# EAGLE schematic guage (EAGLE 7.7.0)
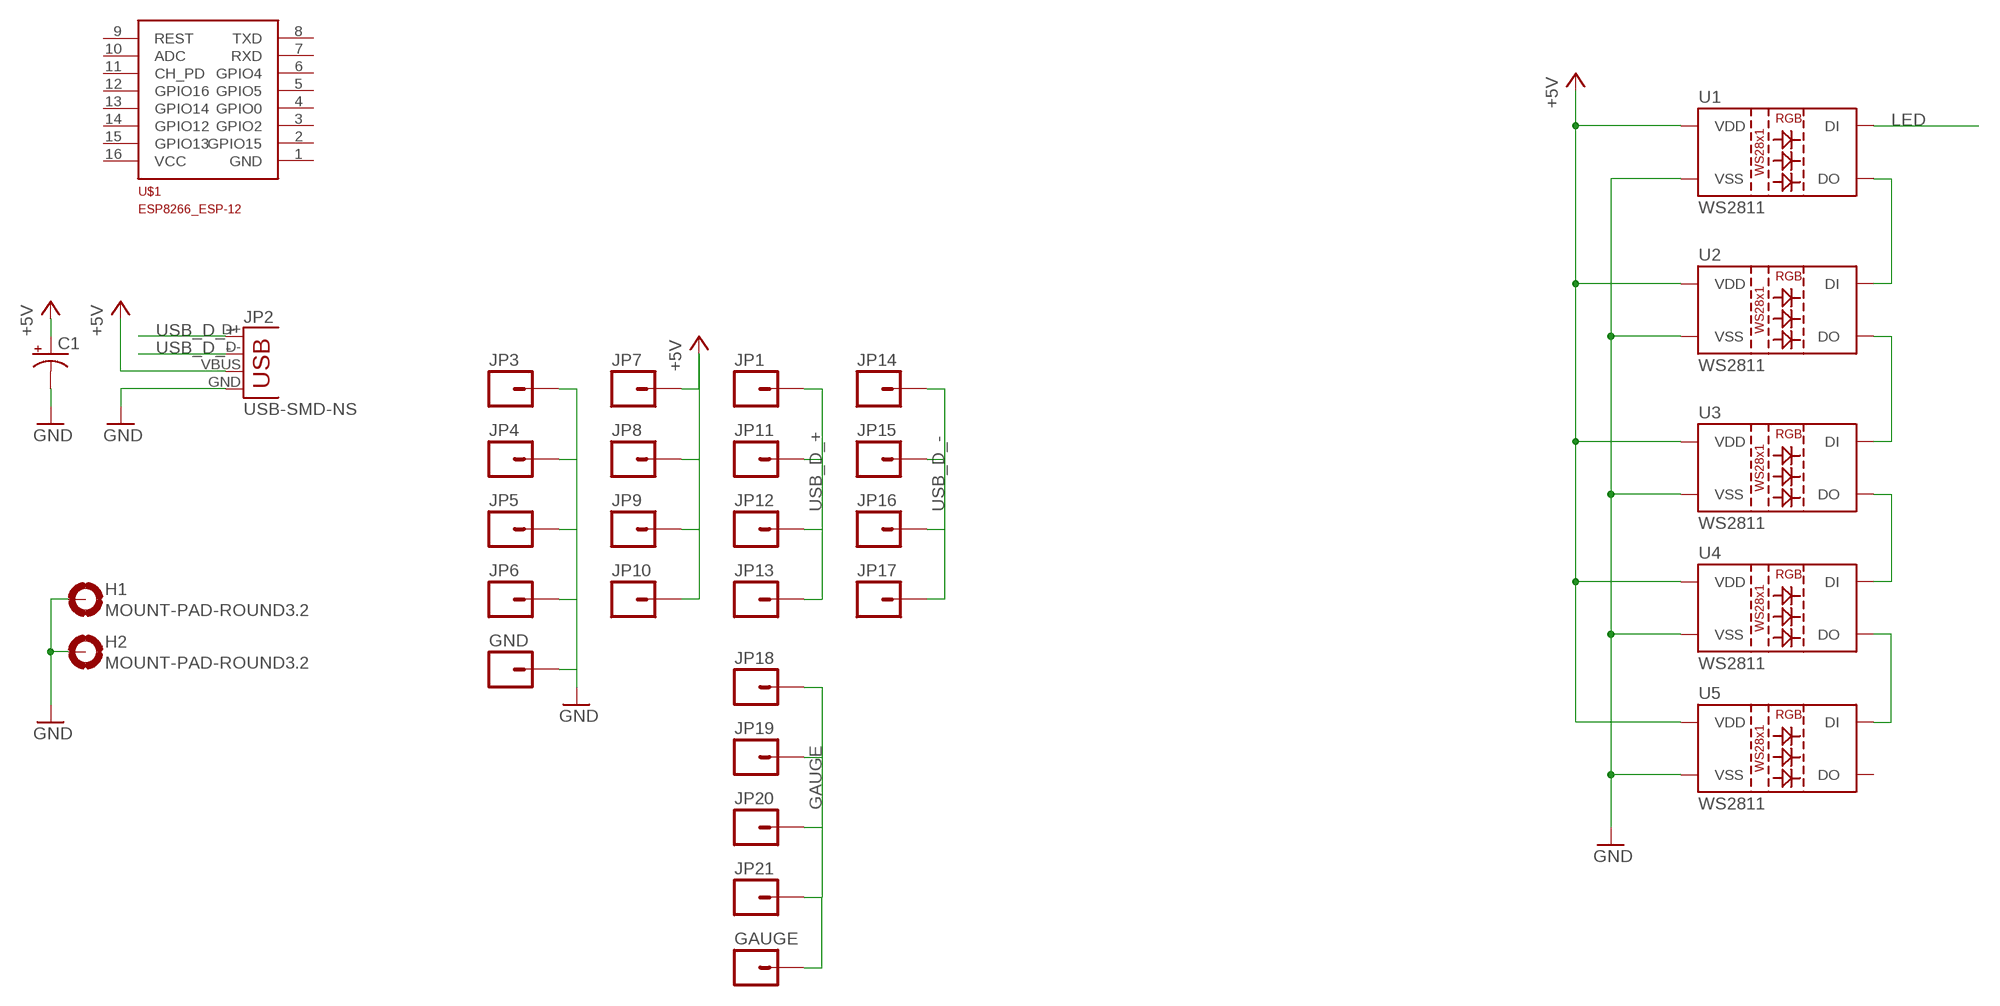
[diagram p0: schematic, sheet 1]

## Parts
C1  100UF-25V-20%(PTH)  [CPOL-RADIAL-100UF-25V]
GAUGE  M01OFFSET  [1X01_OFFSET]
GND  M01OFFSET  [1X01_OFFSET]
H1  MOUNT-PAD-ROUND3.2  [3,2-PAD]
H2  MOUNT-PAD-ROUND3.2  [3,2-PAD]
JP1  M01SMD-4.5X1.5  [PAD-1.5X4.5]
JP2  USB-SMD-NS  [USB-MINIB-NOSTOP]
JP3  M01SMD-4.5X1.5  [PAD-1.5X4.5]
JP4  M01SMD-4.5X1.5  [PAD-1.5X4.5]
JP5  M01SMD-4.5X1.5  [PAD-1.5X4.5]
JP6  M01SMD-4.5X1.5  [PAD-1.5X4.5]
JP7  M01SMD-4.5X1.5  [PAD-1.5X4.5]
JP8  M01SMD-4.5X1.5  [PAD-1.5X4.5]
JP9  M01SMD-4.5X1.5  [PAD-1.5X4.5]
JP10  M01SMD-4.5X1.5  [PAD-1.5X4.5]
JP11  M01SMD-4.5X1.5  [PAD-1.5X4.5]
JP12  M01SMD-4.5X1.5  [PAD-1.5X4.5]
JP13  M01SMD-4.5X1.5  [PAD-1.5X4.5]
JP14  M01SMD-4.5X1.5  [PAD-1.5X4.5]
JP15  M01SMD-4.5X1.5  [PAD-1.5X4.5]
JP16  M01SMD-4.5X1.5  [PAD-1.5X4.5]
JP17  M01SMD-4.5X1.5  [PAD-1.5X4.5]
JP18  M01SMD-4.5X1.5  [PAD-1.5X4.5]
JP19  M01SMD-4.5X1.5  [PAD-1.5X4.5]
JP20  M01SMD-4.5X1.5  [PAD-1.5X4.5]
JP21  M01SMD-4.5X1.5  [PAD-1.5X4.5]
U1  WS2811  LED-TRICOLOR-5050-ICWS2811  [LED-TRICOLOR-5050-IC]
U2  WS2811  LED-TRICOLOR-5050-ICWS2811  [LED-TRICOLOR-5050-IC]
U3  WS2811  LED-TRICOLOR-5050-ICWS2811  [LED-TRICOLOR-5050-IC]
U4  WS2811  LED-TRICOLOR-5050-ICWS2811  [LED-TRICOLOR-5050-IC]
U5  WS2811  LED-TRICOLOR-5050-ICWS2811  [LED-TRICOLOR-5050-IC]
U$1  ESP8266_ESP-12  [ESP8266-ESP12]

## Nets
+5V: C1.1(+) JP2.VBUS JP7.P$1 JP8.P$1 JP9.P$1 JP10.P$1 U1.3(VDD) U1.5(VDD) U2.3(VDD) U2.5(VDD) U3.3(VDD) U3.5(VDD) U4.3(VDD) U4.5(VDD) U5.3(VDD) U5.5(VDD)
GAUGE: GAUGE.1 JP18.P$1 JP19.P$1 JP20.P$1 JP21.P$1
GND: C1.2(-) GND.1 H1.B3,2(MOUNT) H2.B3,2(MOUNT) JP2.GND JP3.P$1 JP4.P$1 JP5.P$1 JP6.P$1 U1.6(VSS) U2.6(VSS) U3.6(VSS) U4.6(VSS) U5.6(VSS)
LED: U1.2(DI)
N$1: U1.1(DO) U2.2(DI)
N$2: U2.1(DO) U3.2(DI)
N$3: U3.1(DO) U4.2(DI)
N$4: U4.1(DO) U5.2(DI)
USB_D_+: JP1.P$1 JP2.D+ JP11.P$1 JP12.P$1 JP13.P$1
USB_D_-: JP2.D- JP14.P$1 JP15.P$1 JP16.P$1 JP17.P$1
Unconnected: U5.1(DO) U$1.1(GND) U$1.2(GPIO15) U$1.3(GPIO2) U$1.4(GPIO0) U$1.5(GPIO5) U$1.6(GPIO4) U$1.7(RXD) U$1.8(TXD) U$1.9(REST) U$1.10(ADC) U$1.11(CH_PD) U$1.12(GPIO16) U$1.13(GPIO14) U$1.14(GPIO12) U$1.15(GPIO13) U$1.16(VCC)

## Library data of the parts
C1 = SparkFun-Capacitors:100UF-25V-20%(PTH): CAP-08439; PROD_ID: CAP-08439
GAUGE GND JP1 JP3-JP21 = SparkFun-Connectors:M01: Header 1 Standard 1-pin 0.1" header. Use with straight break away headers (SKU : PRT-00116), right angle break away headers (PRT-00553), swiss pins (PRT-00743), machine pins (PRT-00117), and female headers (PRT-00115).
H1 H2 = holes:MOUNT-PAD-ROUND: MOUNTING PAD, round
JP2 = SparkFun-Connectors:USB: USB Connectors USB-B-PTH is fully proven SKU : PRT-00139/CONN-08278 USB-miniB is fully proven SKU : PRT-00587 USB-A-PCB is untested. USB-A-H is throughly reviewed, but untested. Spark Fun Electronics SKU : PRT-00437 USB-B-SMT is throughly reviewed, but untested. Needs silkscreen touching up. USB-A-S has not been used/tested USB-MB-H has not been used/tested USB-MICROB has been used. CONN-09505
U1-U5 = SparkFun-LED:LED-TRICOLOR-5050-IC: WS2812 RGB LED w/ WS2811 driver 5x5mm SMD LED with built-in controller IC. DIO-11598; PROD_ID: DIO-11598
U$1 = ESP8266-ESP12:ESP8266_ESP-12